# EAGLE design Gamepad (EAGLE 9.1.1)
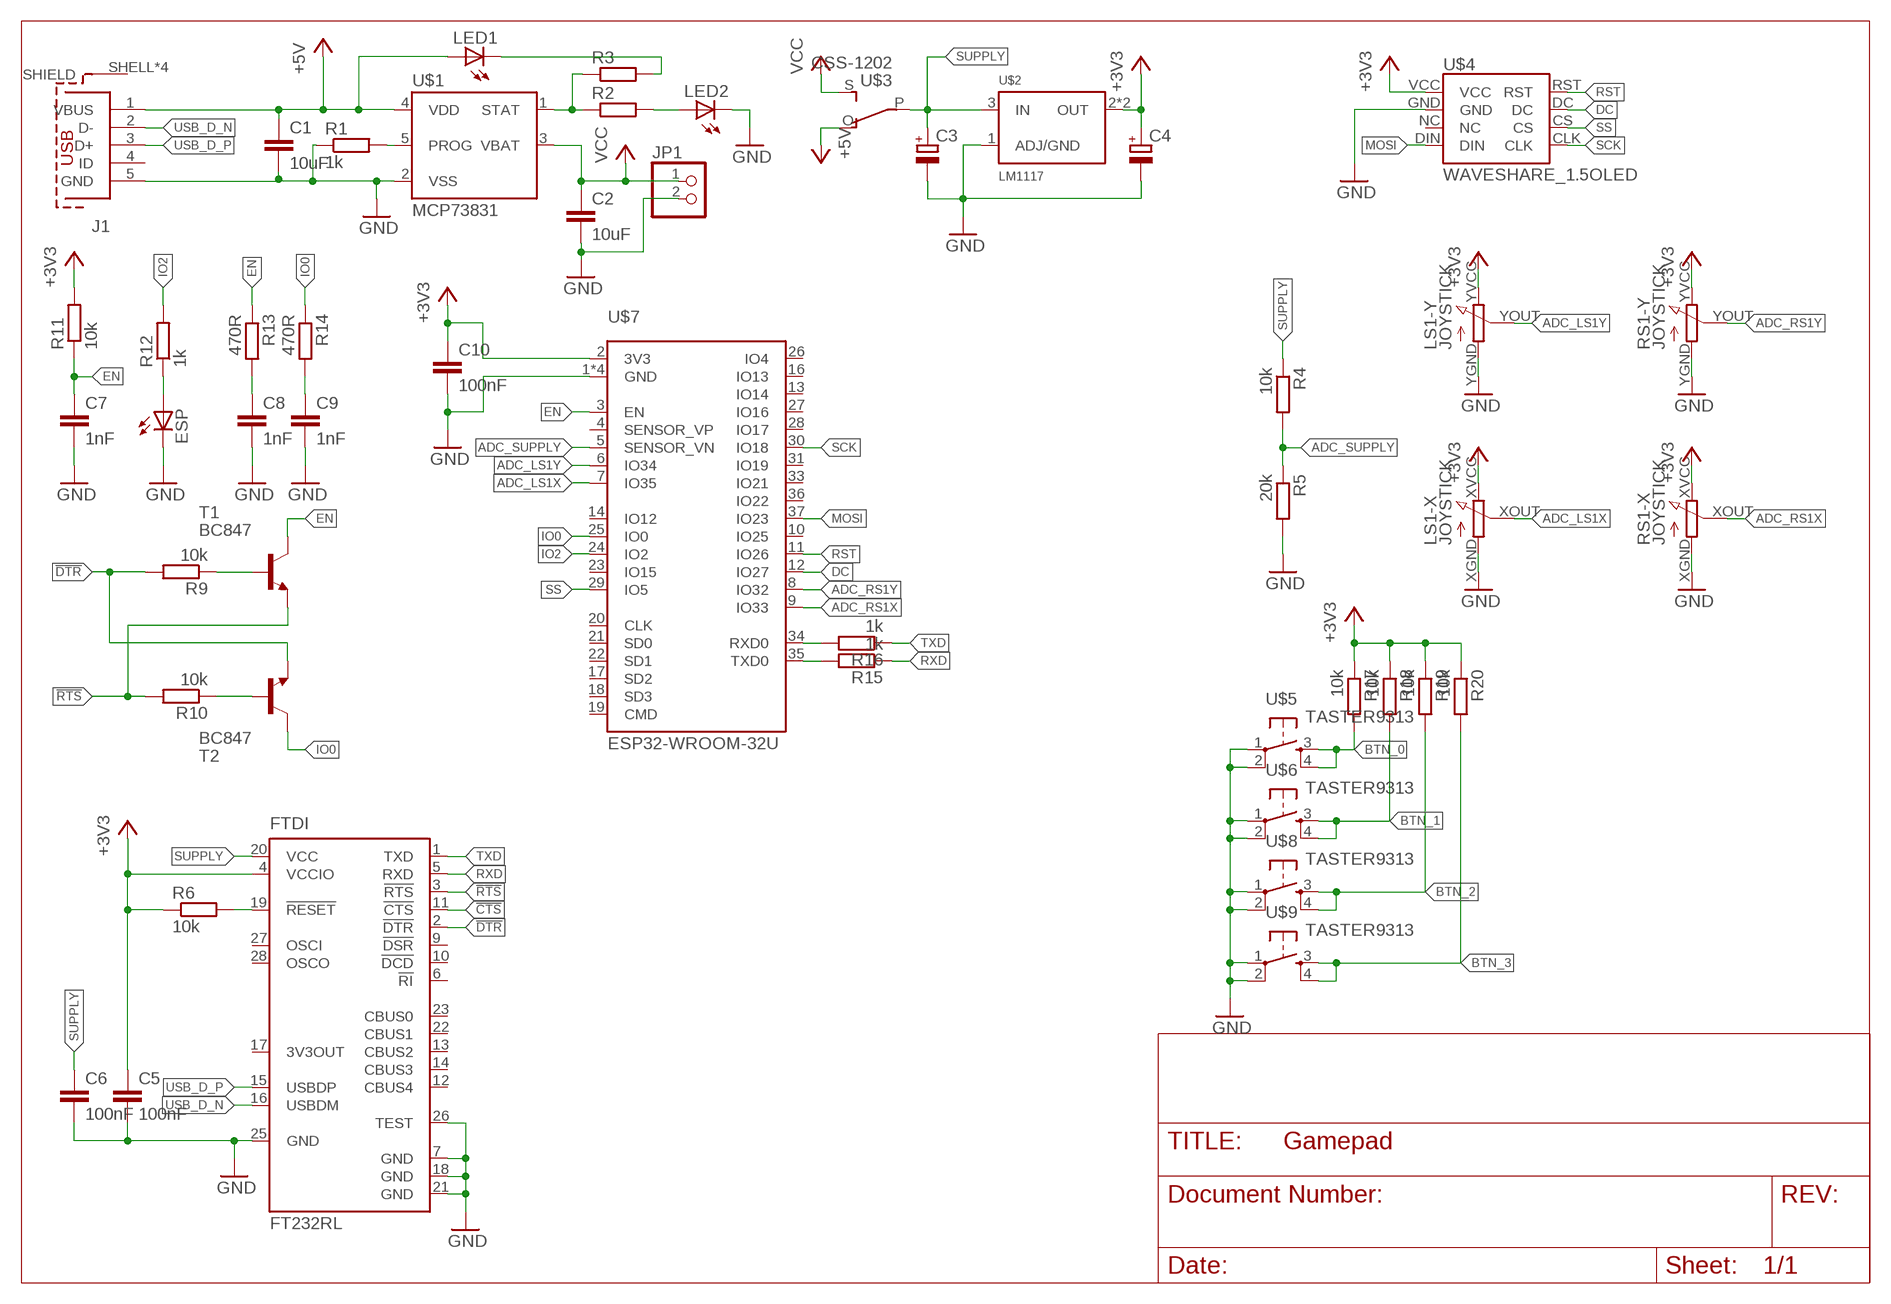
[diagram p0: schematic, sheet 1]

## Parts
C1  10uF  C-EUC0805  [C0805]
C2  10uF  C-EUC0805  [C0805]
C3  CPOL-EUSMCP  [SMC_P]
C4  CPOL-EUSMCP  [SMC_P]
C5  100nF  C-EUC0805  [C0805]
C6  100nF  C-EUC0805  [C0805]
C7  1nF  C-EUC0805  [C0805]
C8  1nF  C-EUC0805  [C0805]
C9  1nF  C-EUC0805  [C0805]
C10  100nF  C-EUC0805  [C0805]
ESP  LEDCHIP-LED0805  [CHIP-LED0805]
FTDI  FT232RL  [SSOP28]
J1  629105136821  [629105136821]
JP1  PINHD-1X2  [1X02]
LED1  LED3MM  [LED3MM]
LED2  LED3MM  [LED3MM]
LS1  JOYSTICK  [JOYSTICK]
R1  1k  R-EU_R0805  [R0805]
R2  R-EU_R0805  [R0805]
R3  R-EU_R0805  [R0805]
R4  10k  R-EU_R0805  [R0805]
R5  20k  R-EU_R0805  [R0805]
R6  10k  R-EU_R0805  [R0805]
R9  10k  R-EU_R0805  [R0805]
R10  10k  R-EU_R0805  [R0805]
R11  10k  R-EU_R0805  [R0805]
R12  1k  R-EU_R0805  [R0805]
R13  470R  R-EU_R0805  [R0805]
R14  470R  R-EU_R0805  [R0805]
R15  1k  R-EU_R0805  [R0805]
R16  1k  R-EU_R0805  [R0805]
R17  10k  R-EU_R0805  [R0805]
R18  10k  R-EU_R0805  [R0805]
R19  10k  R-EU_R0805  [R0805]
R20  10k  R-EU_R0805  [R0805]
RS1  JOYSTICK  [JOYSTICK]
T1  BC847  [SOT23]
T2  BC847  [SOT23]
U$1  MCP73831  [SOT95P280X145-5]
U$2  LM1117  [SOT223]
U$3  CSS-1202  [CSS-1202]
U$4  WAVESHARE_1.5OLED  [WAVESHARE_1.5OLED]
U$5  TASTER9313  [TASTER9313]
U$6  TASTER9313  [TASTER9313]
U$7  ESP32-WROOM-32U  [ESP32-WROOM-32U]
U$8  TASTER9313  [TASTER9313]
U$9  TASTER9313  [TASTER9313]

## Nets
!CTS: FTDI.11(!CTS)
!DTR: FTDI.2(!DTR) R9.2 T2.2(E)
!RTS: FTDI.3(!RTS) R10.2 T1.2(E)
+3V3: C4.+ C5.1 C10.1 FTDI.4(VCCIO) LS1.XVCC(-X:VCC) LS1.YVCC(-Y:VCC) R6.1 R11.2 R17.1 R18.1 R19.1 R20.1 RS1.XVCC(-X:VCC) RS1.YVCC(-Y:VCC) U$2.2(OUT) U$2.4(OUT) U$4.VCC U$7.2(3V3)
+5V: C1.1 J1.1(VBUS) LED1.A U$1.4(VDD) U$3.O
ADC_LS1X: LS1.XOUT(-X:OUT) U$7.7(IO35)
ADC_LS1Y: LS1.YOUT(-Y:OUT) U$7.6(IO34)
ADC_RS1X: RS1.XOUT(-X:OUT) U$7.9(IO33)
ADC_RS1Y: RS1.YOUT(-Y:OUT) U$7.8(IO32)
ADC_SUPPLY: R4.2 R5.1 U$7.5(SENSOR_VN)
BTN_0: R17.2 U$5.3(S) U$5.4(S1)
BTN_1: R18.2 U$6.3(S) U$6.4(S1)
BTN_2: R19.2 U$8.3(S) U$8.4(S1)
BTN_3: R20.2 U$9.3(S) U$9.4(S1)
DC: U$4.DC U$7.12(IO27)
EN: C7.1 R11.1 R13.1 T1.3(C) U$7.3(EN)
GND: C1.2 C2.2 C3.- C4.- C5.2 C6.2 C7.2 C8.2 C9.2 C10.2 ESP.C FTDI.7(GND) FTDI.18(GND) FTDI.21(GND) FTDI.25(GND) FTDI.26(TEST) J1.5(GND) JP1.2 LED2.K(C) LS1.XGND(-X:GND) LS1.YGND(-Y:GND) R1.1 R5.2 RS1.XGND(-X:GND) RS1.YGND(-Y:GND) U$1.2(VSS) U$2.1(ADJ/GND) U$4.GND U$5.1(P) U$5.2(P1) U$6.1(P) U$6.2(P1) U$7.1(GND) U$7.15(GND) U$7.38(GND) U$7.39(GND) U$8.1(P) U$8.2(P1) U$9.1(P) U$9.2(P1)
IO0: R14.1 T2.3(C) U$7.25(IO0)
IO2: R12.2 U$7.24(IO2)
MOSI: U$4.DIN U$7.37(IO23)
N$1: R2.1 R3.1 U$1.1(STAT)
N$2: FTDI.19(!RESET) R6.2
N$3: R1.2 U$1.5(PROG)
N$4: LED1.K(C) R3.2
N$5: LED2.A R2.2
N$10: R9.1 T1.1(B)
N$11: R10.1 T2.1(B)
N$12: ESP.A R12.1
N$13: C8.1 R13.2
N$14: C9.1 R14.2
N$20: R16.2 U$7.34(RXD0)
N$21: R15.2 U$7.35(TXD0)
RST: U$4.RST U$7.11(IO26)
RXD: FTDI.5(RXD) R15.1
SCK: U$4.CLK U$7.30(IO18)
SS: U$4.CS U$7.29(IO5)
SUPPLY: C3.+ C6.1 FTDI.20(VCC) R4.1 U$2.3(IN) U$3.P
TXD: FTDI.1(TXD) R16.1
USB_D_N: FTDI.16(USBDM) J1.2(D-)
USB_D_P: FTDI.15(USBDP) J1.3(D+)
VCC: C2.1 JP1.1 U$1.3(VBAT) U$3.S
Unconnected: FTDI.6(!RI) FTDI.9(!DSR) FTDI.10(!DCD) FTDI.12(CBUS4) FTDI.13(CBUS2) FTDI.14(CBUS3) FTDI.17(3V3OUT) FTDI.22(CBUS1) FTDI.23(CBUS0) FTDI.27(OSCI) FTDI.28(OSCO) J1.4(ID) J1.SHELL1(SHIELD) J1.SHELL2(SHIELD) J1.SHELL3(SHIELD) J1.SHELL(SHIELD) U$4.NC U$7.4(SENSOR_VP) U$7.10(IO25) U$7.13(IO14) U$7.14(IO12) U$7.16(IO13) U$7.17(SD2) U$7.18(SD3) U$7.19(CMD) U$7.20(CLK) U$7.21(SD0) U$7.22(SD1) U$7.23(IO15) U$7.26(IO4) U$7.27(IO16) U$7.28(IO17) U$7.31(IO19) U$7.33(IO21) U$7.36(IO22)

## Library data of the parts
C1 C2 C5-C10 = rcl:C-EU: CAPACITOR, European symbol; SPICEPREFIX: C
C3 C4 = rcl:CPOL-EU: POLARIZED CAPACITOR, European symbol; SPICEPREFIX: C
ESP LED1 LED2 = led:LED: LED OSRAM: - CHIPLED LG R971, LG N971, LY N971, LG Q971, LY Q971, LO R971, LY R971 LH N974, LH R974 LS Q976, LO Q976, LY Q976 LO Q996 - Hyper CHIPLED LW Q18S LB Q993, LB Q99A, LB R99A - SideLED LS A670, LO A670, LY A670, LG A670, LP A670 LB A673, LV A673, LT A673, LW A673 LH A674 LY A675 LS A676, LA A676, LO A676, LY A676, LW A676 LS A679, LY A679, LG A679 - Hyper Micro SIDELED® LS Y876, LA Y876, LO Y876, LY Y876 LT Y87S - SmartLED LW L88C, LW L88S LB L89C, LB L89S, LG L890 LS L89K, LO L89K, LY L89K LS L896, LA L896, LO L896, LY L896 - TOPLED LS T670, LO T670, LY T670, LG T670, LP T670 LSG T670, LSP T670, LSY T670, LOP T670, LYG T670 LG T671, LOG T671, LSG T671 LB T673, LV T673, LT T673, LW T673 LH T674 LS T676, LA T676, LO T676, LY T676, LB T676, LH T676, LSB T676, LW T676 LB T67C, LV T67C, LT T67C, LS T67K, LO T67K, LY T67K, LW E67C LS E67B, LA E67B, LO E67B, LY E67B, LB E67C, LV E67C, LT E67C LW T67C LS T679, LY T679, LG T679 LS T770, LO T770, LY T770, LG T770, LP T770 LB T773, LV T773, LT T773, LW T773 LH T774 LS E675, LA E675, LY E675, LS T675 LS T776, LA T776, LO T776, LY T776, LB T776 LHGB T686 LT T68C, LB T68C - Hyper Mini TOPLED® LB M676 - Mini TOPLED Santana® LG M470 LS M47K, LO M47K, LY M47K Source: http://www.osram.convergy.de LUXEON: - LUMILED® LXK2-PW12-R00, LXK2-PW12-S00, LXK2-PW14-U00, LXK2-PW14-V00 LXK2-PM12-R00, LXK2-PM12-S00, LXK2-PM14-U00 LXK2-PE12-Q00, LXK2-PE12-R00, LXK2-PE12-S00, LXK2-PE14-T00, LXK2-PE14-U00 LXK2-PB12-K00, LXK2-PB12-L00, LXK2-PB12-M00, LXK2-PB14-N00, LXK2-PB14-P00, LXK2-PB14-Q00 LXK2-PR12-L00, LXK2-PR12-M00, LXK2-PR14-Q00, LXK2-PR14-R00 LXK2-PD12-Q00, LXK2-PD12-R00, LXK2-PD12-S00 LXK2-PH12-R00, LXK2-PH12-S00 LXK2-PL12-P00, LXK2-PL12-Q00, LXK2-PL12-R00 Source: www.luxeon.com KINGBRIGHT: KA-3528ASYC Source: www.kingbright.com
FTDI = ftdichip:FT232R: Source: http://www.ftdichip.com/Documents/DataSheets/DS_FT232R_v104.pdf; MPN: FT232RL; OC_FARNELL: 1146032; OC_NEWARK: 91K9918
J1 = InputOutputIO (rev18a):629105136821: WR-COM SMT Horizontal 5 Contacts Micro USB Type B,5 pins=>Code : Con_I-O_COM_MicroUSB_629105136821 <http://katalog.we-online.de/media/images/eican/Con_I-O_COM_MicroUSB_629105136821_pf2.jpg> Details see: http://katalog.we-online.de/en/em/COM_MICRO_SMT_TYPE_B_HORIZONTAL/629105136821?m Created 2014-07-09, Karrer Zheng 2014 (C) Würth Elektronik
JP1 = pinhead:PINHD-1X2: PIN HEADER
LS1 RS1 = HeRo:JOYSTICK
R1-R6 R9-R20 = rcl:R-EU_: RESISTOR, European symbol; SPICEPREFIX: R
T1 T2 = transistor:BC847: NPN TRANSISTOR
U$1 = HeRo:MCP73831
U$2 = RPI:LM1117
U$3 = HeRo:CSS-1202
U$4 = HeRo:WAVESHARE_1.5OLED
U$5 U$6 U$8 U$9 = HeRo:TASTER9313
U$7 = HeRo:ESP32-WROOM-32U

## Board
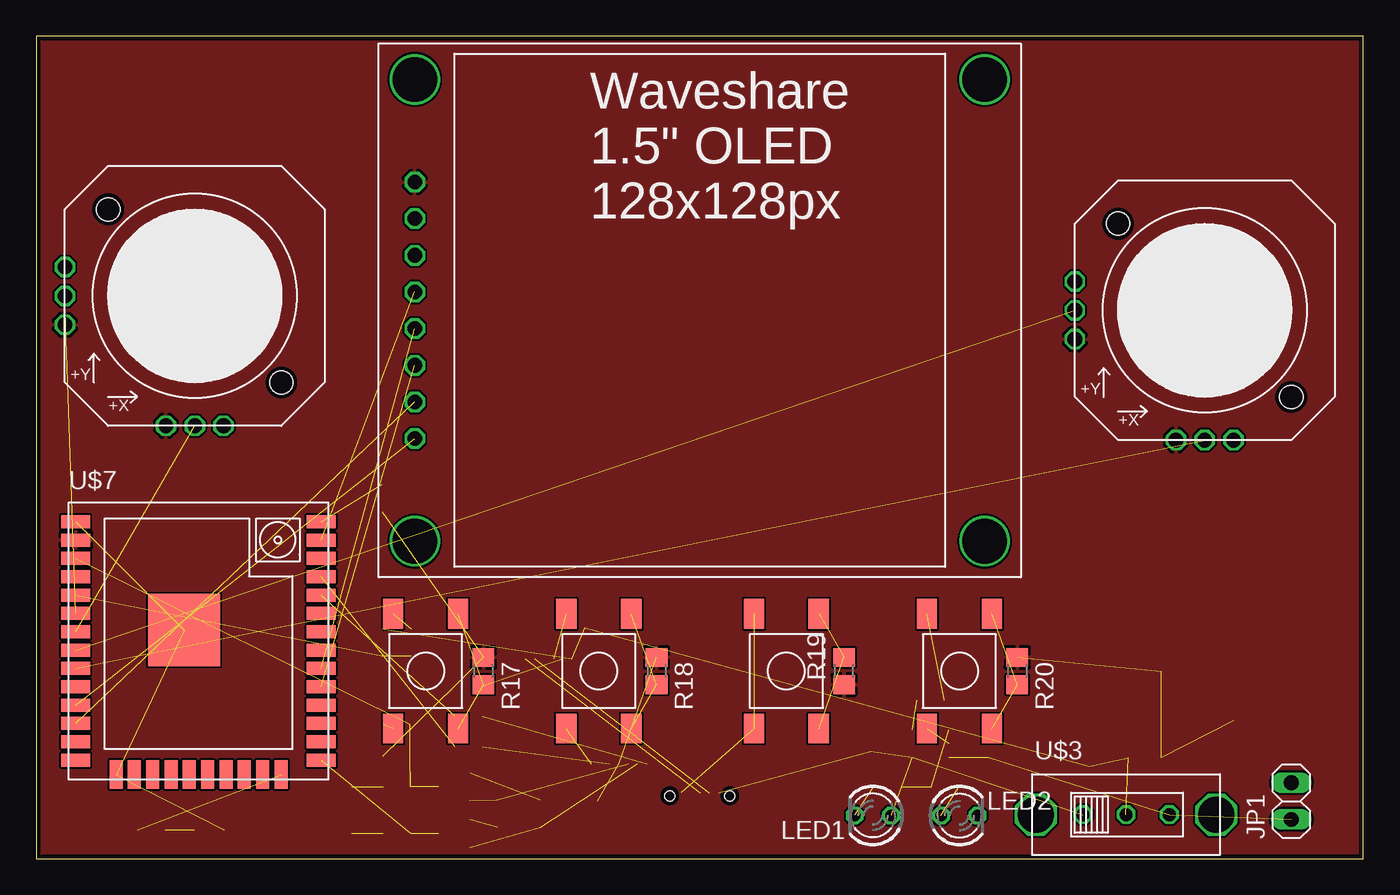
[diagram p1: board, top side]
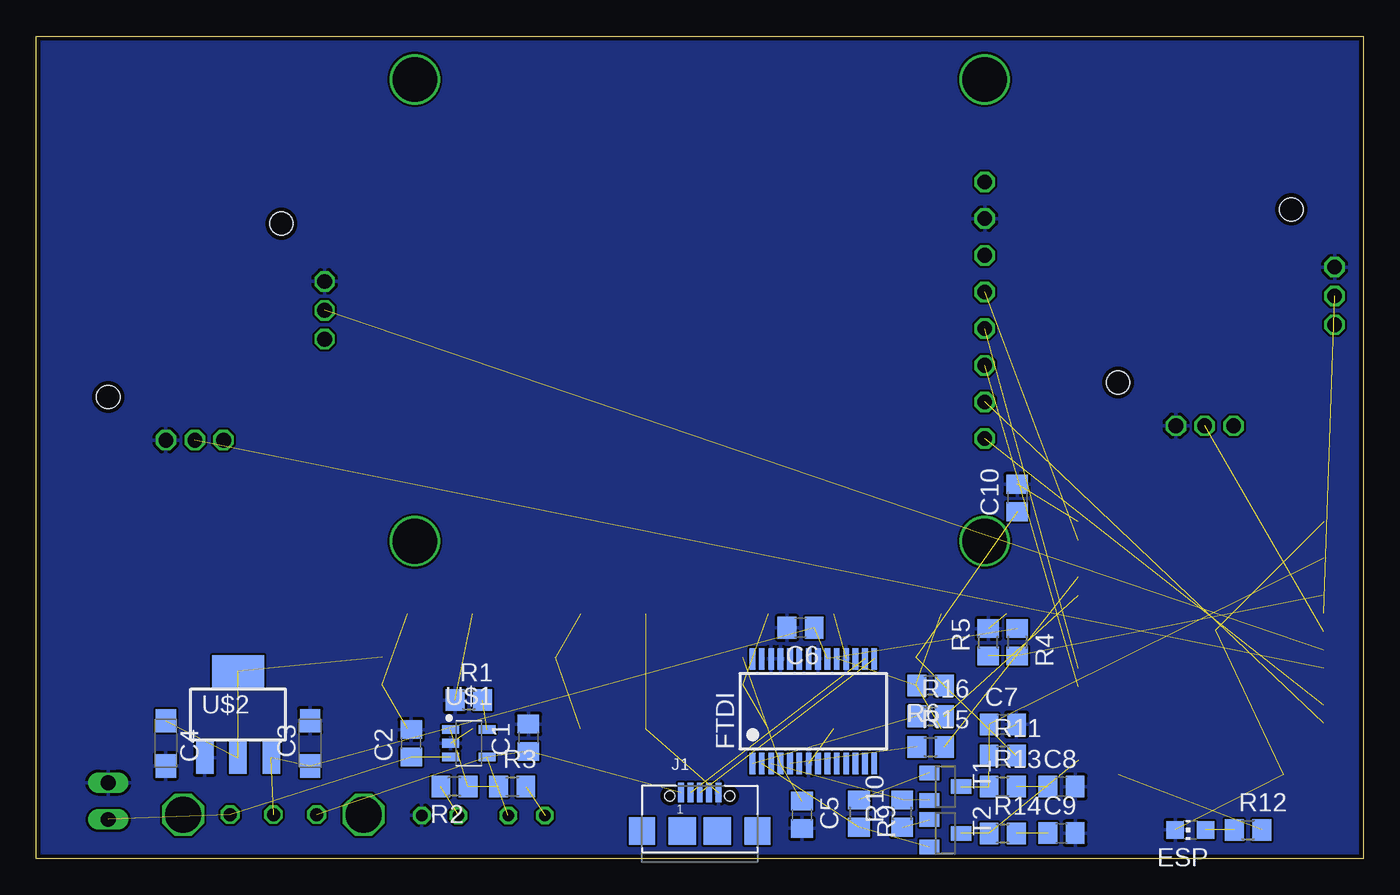
[diagram p2: board, bottom side, seen from below]

Size 92 x 57 mm. Coordinates in mm from the lower left corner, seen from the top.
Outline: 0,0 92,0 92,57 0,57 0,0
Copper layers (1*16): Top 0.035mm / dielectric 1.5mm / Bottom 0.035mm
Design rules "PCB-POOL Standard": minimum track width 0.15mm, minimum drill 0.3mm, track to track 0.15mm, track to pad 0.15mm, pad to pad 0.15mm, via to via 0.15mm, smd to smd 0.15mm, copper to edge 0.3mm, drill to drill 0.2mm, minimum pad ring 0.2mm, minimum via ring 0.15mm, stop-mask expansion 0.075mm, vias tented up to drill 0mil, thermal gap 0.2mm

### Footprints (pad centres in the part's own frame; a part is rotated, then mirrored left to right if it is on the bottom)
C0805 = smd 1.3 x 1.5: 1 -0.95,0; 2 0.95,0
SMC_P = smd 1.6 x 1.4: + -1.575,0; - 1.575,0
CHIP-LED0805 = smd 1.2 x 1.2: A 0,-1.05; C 0,1.05
SSOP28 = smd 0.4 x 1.5: 1 -4.225,-3.625; 2 -3.575,-3.625; 3 -2.925,-3.625; 4 -2.275,-3.625; 5 -1.625,-3.625; 6 -0.975,-3.625; 7 -0.325,-3.625; 8 0.325,-3.625; 9 0.975,-3.625; 10 1.625,-3.625; 11 2.275,-3.625; 12 2.925,-3.625; 13 3.575,-3.625; 14 4.225,-3.625; 15 4.225,3.625; 16 3.575,3.625; 17 2.925,3.625; 18 2.275,3.625; 19 1.625,3.625; 20 0.975,3.625; 21 0.325,3.625; 22 -0.325,3.625; 23 -0.975,3.625; 24 -1.625,3.625; 25 -2.275,3.625; 26 -2.925,3.625; 27 -3.575,3.625; 28 -4.225,3.625
629105136821 = smd 0.4 x 1.35: 1 -1.3,2.675; 2 -0.65,2.675; 3 0,2.675; 4 0.65,2.675; 5 1.3,2.675 | smd 1.8 x 1.9: SHELL -4,0; SHELL3 4,0 | smd 1.9 x 1.9: SHELL1 -1.2,0; SHELL2 1.2,0 | hole 0.7: -2.075,2.45; 2.075,2.45
1X02 = drill 1.016 long: 1 -1.27,0; 2 1.27,0
LED3MM = drill 0.813 octagon: A -1.27,0; K 1.27,0
JOYSTICK = drill 1.016 octagon: XGND 2,-9; XOUT 0,-9; XVCC -2,-9; YGND -9,2; YOUT -9,0; YVCC -9,-2 | hole 1.6: -6,6; 6,-6
R0805 = smd 1.3 x 1.5: 1 -0.95,0; 2 0.95,0
SOT23 = smd 1 x 1.4: 1 -0.95,-1.1; 2 0.95,-1.1; 3 0,1.1
SOT95P280X145-5 = smd 1.186 x 0.597: 1 -1.264,0.95; 2 -1.264,0; 3 -1.264,-0.95; 4 1.264,-0.95; 5 1.264,0.95
SOT223 = smd 1.219 x 2.235: 1 -2.3,-3; 2 0,-3; 3 2.3,-3 | smd 3.6 x 2.2: 4 0,3
CSS-1202 = drill 2.5 octagon: CASE1 -6.25,0; CASE2 6.25,0 | drill 0.9 octagon: O -3,0; P 0,0; S 3,0
WAVESHARE_1.5OLED = drill 1.016 octagon: CLK -19.75,-1.27; CS -19.75,-3.81; DC -19.75,-6.35; DIN -19.75,1.27; GND -19.75,6.35; NC -19.75,3.81; RST -19.75,-8.89; VCC -19.75,8.89 | drill 3.1: P$1 -19.75,16; P$2 19.75,16; P$3 -19.75,-16; P$4 19.75,-16
TASTER9313 = smd 2.05 x 1.4: 1 -3.975,2.25; 2 3.975,2.25; 3 -3.975,-2.25; 4 3.975,-2.25
ESP32-WROOM-32U = smd 2 x 0.9: 1 -8.5,8.255; 2 -8.5,6.985; 3 -8.5,5.715; 4 -8.5,4.445; 5 -8.5,3.175; 6 -8.5,1.905; 7 -8.5,0.635; 8 -8.5,-0.635; 9 -8.5,-1.905; 10 -8.5,-3.175; 11 -8.5,-4.445; 12 -8.5,-5.715; 13 -8.5,-6.985; 14 -8.5,-8.255; 25 8.5,-8.255; 26 8.5,-6.985; 27 8.5,-5.715; 28 8.5,-4.445; 29 8.5,-3.175; 30 8.5,-1.905; 31 8.5,-0.635; 32 8.5,0.635; 33 8.5,1.905; 34 8.5,3.175; 35 8.5,4.445; 36 8.5,5.715; 37 8.5,6.985; 38 8.5,8.255 | smd 0.9 x 2: 15 -5.715,-9.255; 16 -4.445,-9.255; 17 -3.175,-9.255; 18 -1.905,-9.255; 19 -0.635,-9.255; 20 0.635,-9.255; 21 1.905,-9.255; 22 3.175,-9.255; 23 4.445,-9.255; 24 5.715,-9.255 | smd 5 x 5: 39 -1,0.755

### Placement (x,y rotation side)
C1  57.88,8.38 90 bottom
C2  66,8 90 bottom
C3  73,8 90 bottom
C4  83,8 270 bottom
C5  38.91,3.05 270 bottom
C6  39.01,16 180 bottom
C7  24.99,9.3 0 bottom
C8  20.93,5 0 bottom
C9  20.93,1.78 0 bottom
C10  24,25 90 bottom
ESP  12,2 90 bottom
FTDI  38.13,10.22 0 bottom
J1  46,1.91 0 bottom
JP1  87,4 90 top
LED1  58,3 180 top
LED2  64,3 0 top
LS1  11,39 0 top
R1  62,11 0 bottom
R2  63,5 180 bottom
R3  59,5 0 bottom
R4  24,15 270 bottom
R5  26,15 90 bottom
R6  30,12 180 bottom
R9  34.97,3.13 270 bottom
R10  31.97,3.13 90 bottom
R11  24.99,7.14 0 bottom
R12  8,2 0 bottom
R13  25,5 0 bottom
R14  25,1.76 0 bottom
R15  30,7.75 0 bottom
R16  30,9.87 0 bottom
R17  31,13 270 top
R18  43,13 270 top
R19  56,13 90 top
R20  68,13 270 top
RS1  81,38 0 top
T1  28.98,5 270 bottom
T2  28.98,1.76 270 bottom
U$1  62,8 0 bottom
U$2  78,10 0 bottom
U$3  75.55,3.06 0 top
U$4  46,38 0 top
U$5  27,13 90 top
U$6  39,13 90 top
U$7  11.26,15.09 0 top
U$8  52,13 90 top
U$9  64,13 90 top

### Tracks (layer width: path | path; a pad name or v marks a point on that pad's centre or on a via)
!DTR  (2 unrouted)
!RTS  (2 unrouted)
+3V3  (8 unrouted)
  pour Top: 0,57 92,57 92,0 0,0
+5V  (4 unrouted)
ADC_LS1X  (1 unrouted)
ADC_LS1Y  (1 unrouted)
ADC_RS1X  (1 unrouted)
ADC_RS1Y  (1 unrouted)
ADC_SUPPLY  (2 unrouted)
BTN_0  (2 unrouted)
BTN_1  (2 unrouted)
BTN_2  (2 unrouted)
BTN_3  (2 unrouted)
DC  (1 unrouted)
EN  (4 unrouted)
GND  (12 unrouted)
  pour Bottom: 0,57 92,57 92,0 0,0
IO0  (2 unrouted)
IO2  (1 unrouted)
MOSI  (1 unrouted)
N$1  (2 unrouted)
N$2  (1 unrouted)
N$3  (1 unrouted)
N$4  (1 unrouted)
N$5  (1 unrouted)
N$10  (1 unrouted)
N$11  (1 unrouted)
N$12  (1 unrouted)
N$13  (1 unrouted)
N$14  (1 unrouted)
N$20  (1 unrouted)
N$21  (1 unrouted)
RST  (1 unrouted)
RXD  (1 unrouted)
SCK  (1 unrouted)
SS  (1 unrouted)
SUPPLY  (5 unrouted)
TXD  (1 unrouted)
USB_D_N  (1 unrouted)
USB_D_P  (1 unrouted)
VCC  (3 unrouted)